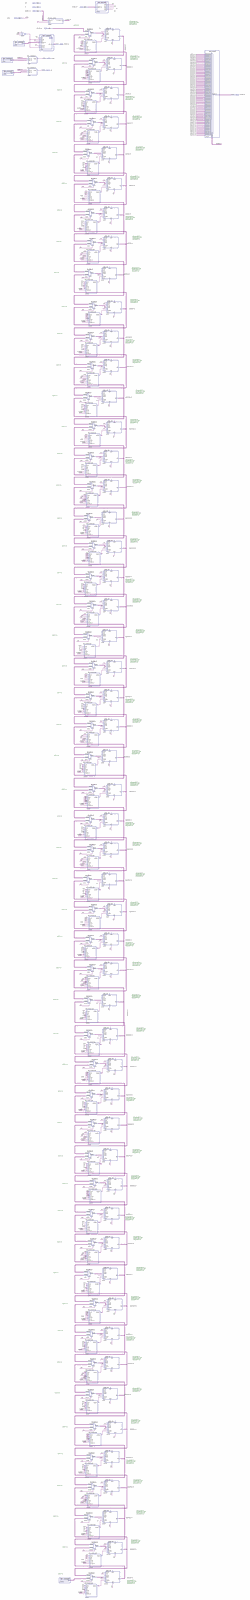
[diagram p0: schematic sheet, whole]
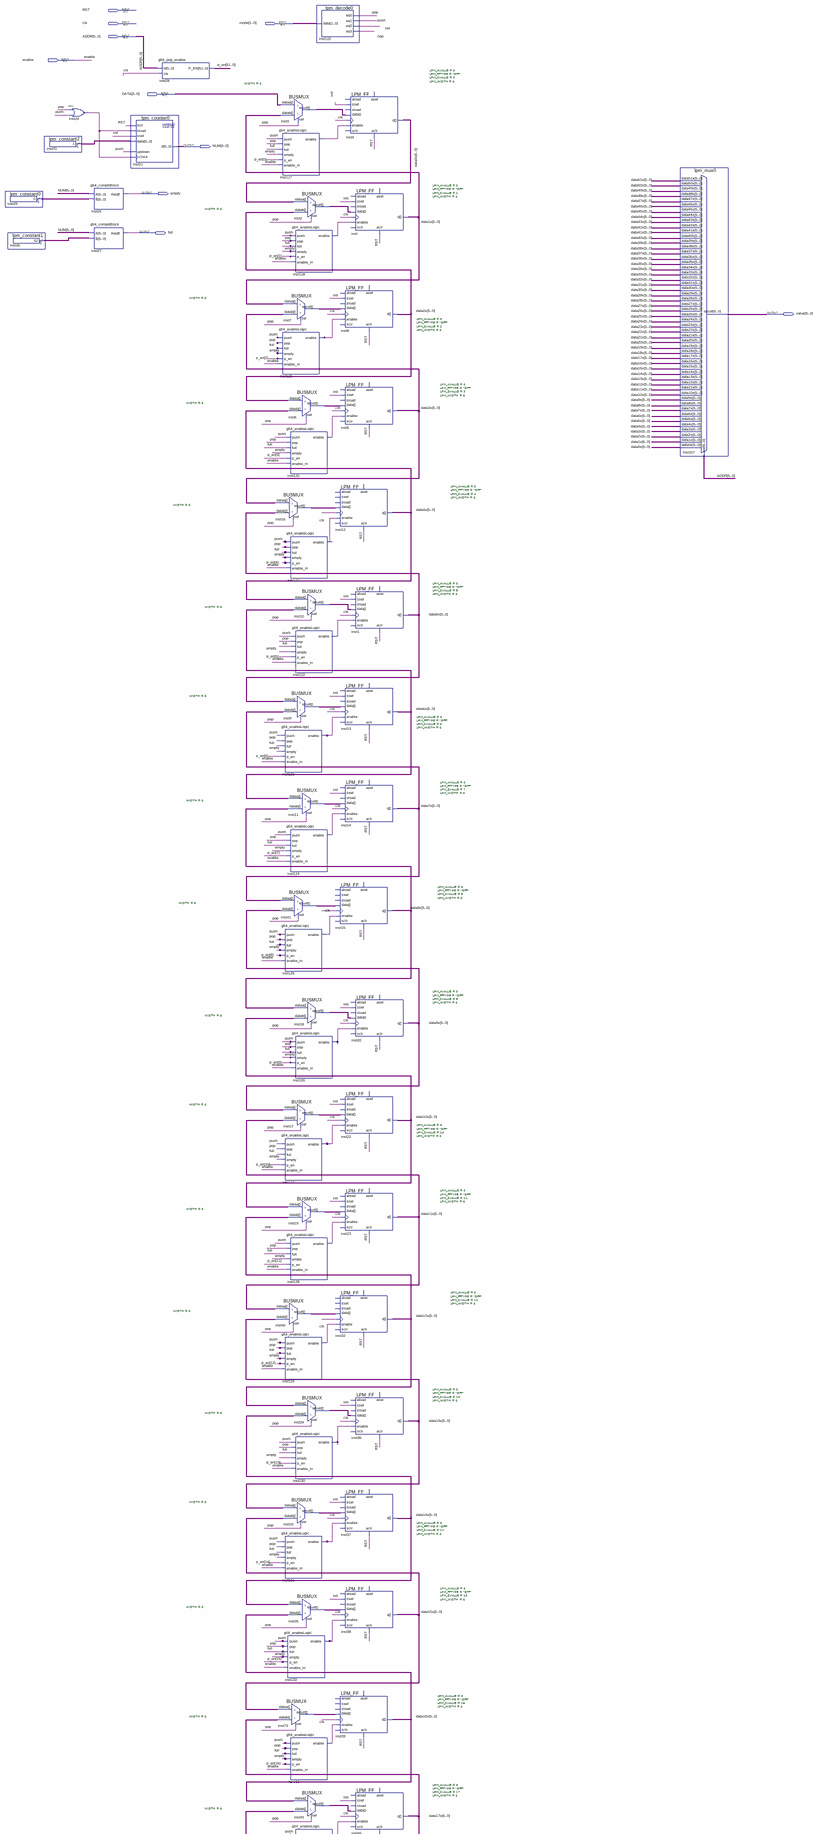
[diagram p1: schematic sheet, upper part]
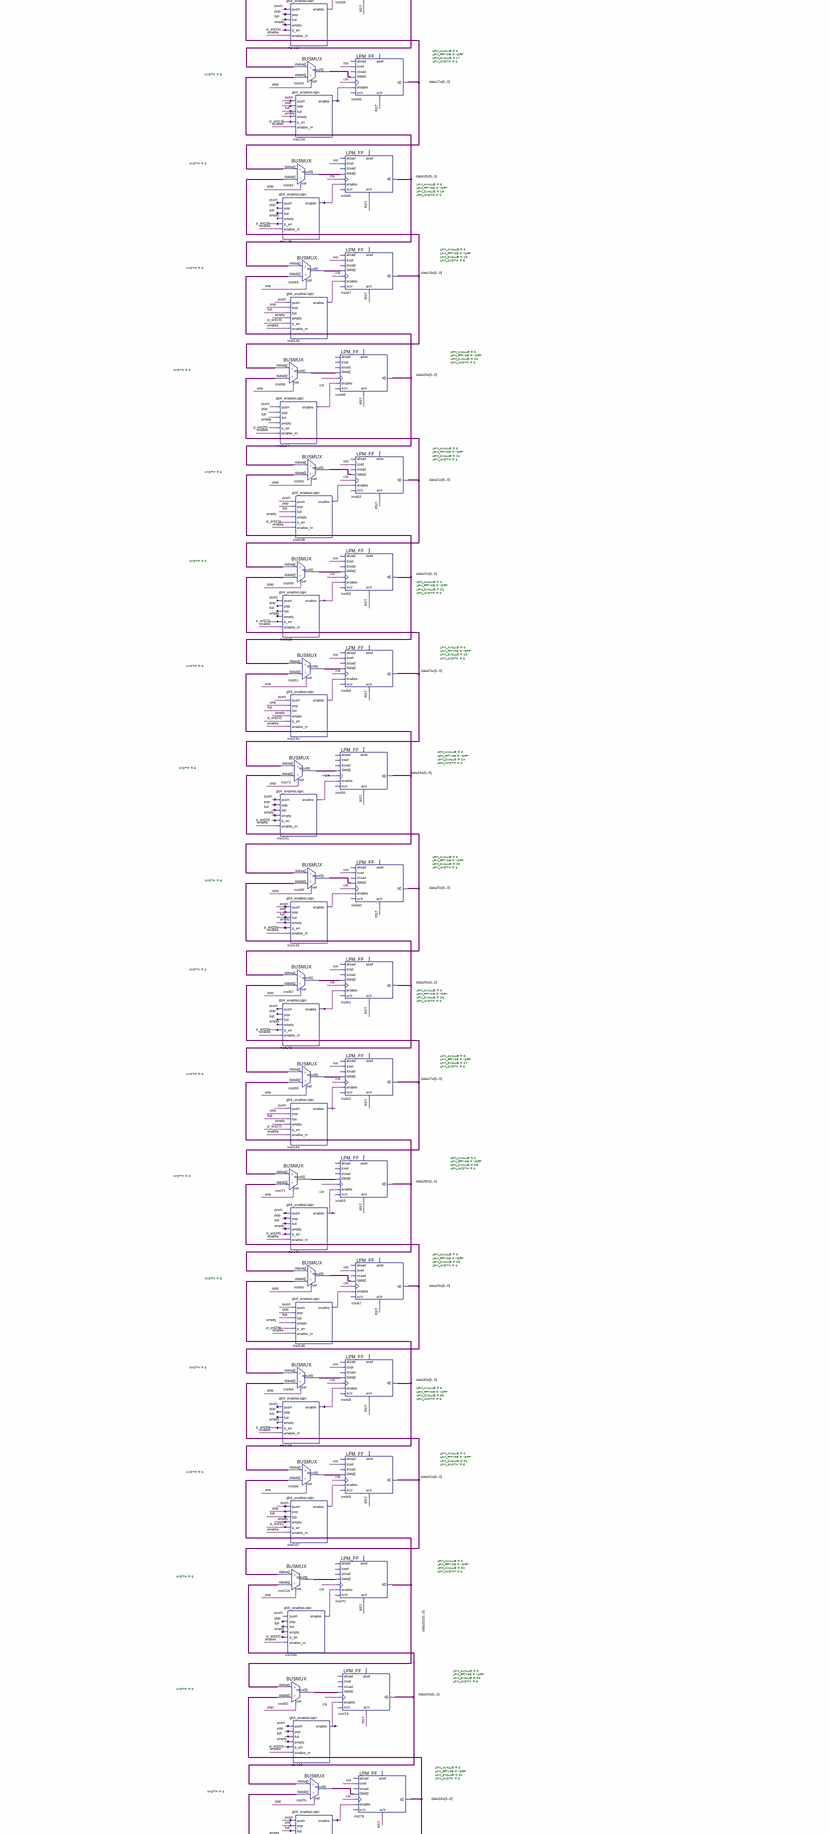
[diagram p2: schematic sheet, middle part]
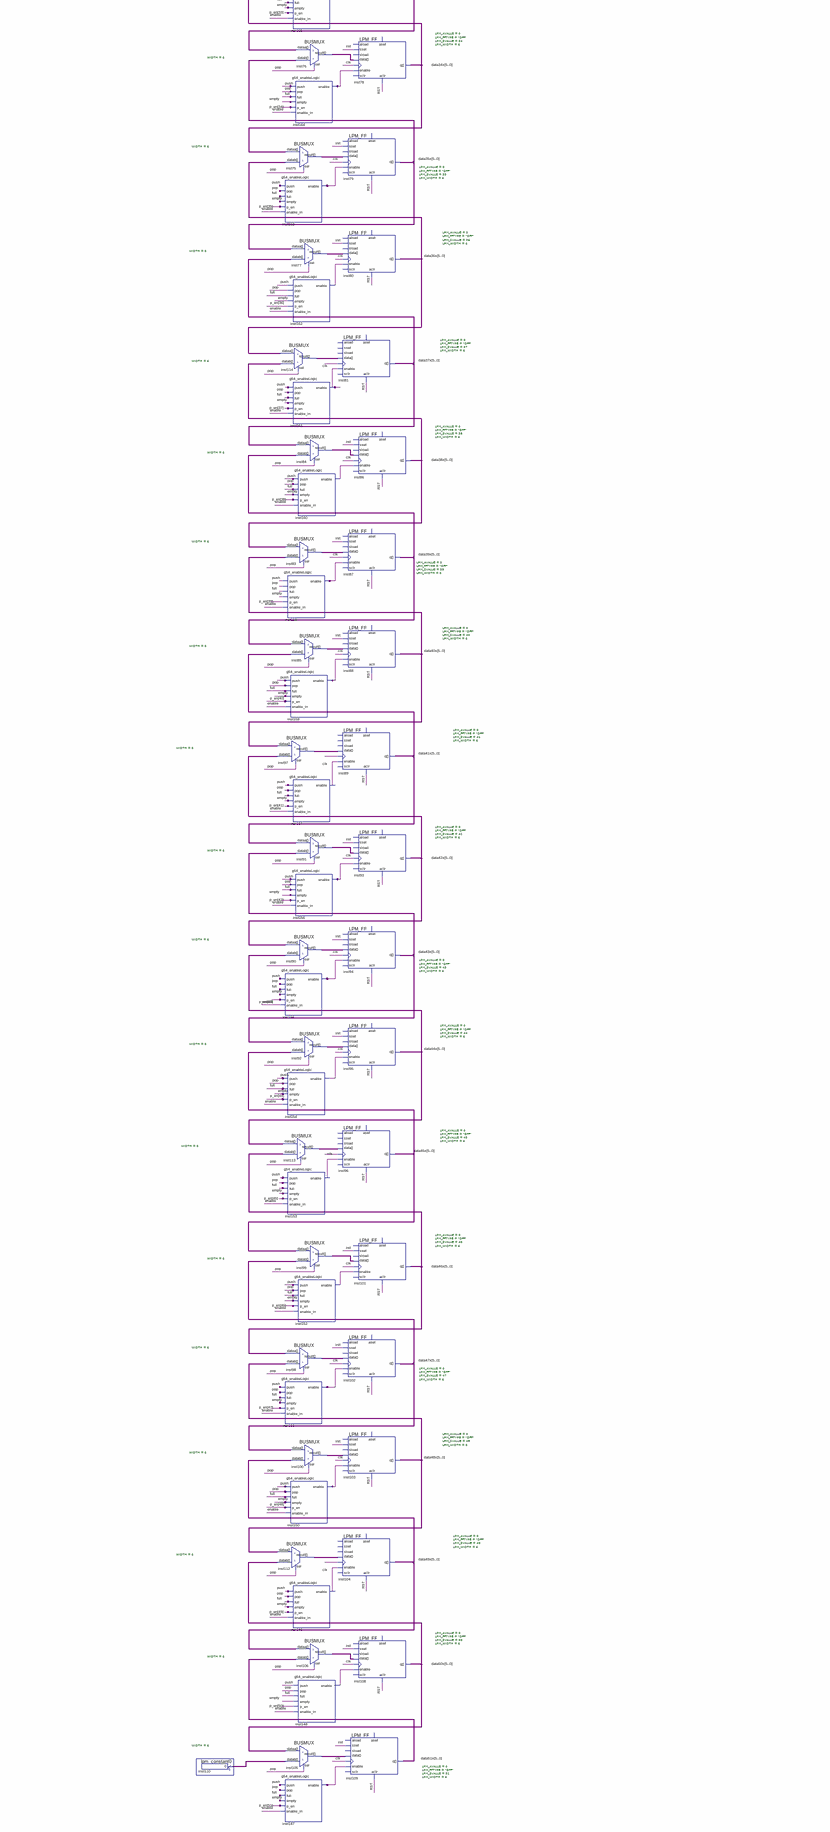
[diagram p3: schematic sheet, lower part]
// Quartus schematic g54_stack52.bdf as structural Verilog: 167 symbols, 10 pins
module g54_stack52 (
  input  RST,
  input  clk,
  input  [1:0] mode,
  input  [5:0] ADDR,
  input  enable,
  input  [5:0] DATA,
  output [5:0] NUM,
  output empty,
  output full,
  output [5:0] value
);

  wire init, inst24_out, inst117_enable, inst118_enable, inst119_enable, inst120_enable, inst121_enable,
       inst122_enable, inst123_enable, inst124_enable, inst125_enable, inst126_enable, inst127_enable,
       inst128_enable, inst129_enable, inst130_enable, inst131_enable, inst132_enable, inst133_enable,
       inst134_enable, inst135_enable, inst136_enable, inst137_enable, inst138_enable, inst139_enable,
       inst140_enable, inst141_enable, inst142_enable, inst143_enable, inst144_enable, inst145_enable,
       inst146_enable, inst147_enable, inst148_enable, inst149_enable, inst150_enable, inst151_enable,
       inst152_enable, inst153_enable, inst154_enable, inst155_enable, inst156_enable, inst157_enable,
       inst158_enable, inst159_enable, inst160_enable, inst161_enable, inst162_enable, inst163_enable,
       inst164_enable, inst165_enable, inst166_enable, inst167_enable, inst168_enable, nop, pop, push;
  wire [5:0] data0x, data1x, data2x, data3x, data4x, data5x, data6x, data7x, data8x, data9x, data10x,
       data11x, data12x, data13x, data14x, data15x, data16x, data17x, data18x, data19x, data20x, data21x,
       data22x, data23x, data24x, data25x, data26x, data27x, data28x, data29x, data30x, data31x, data32x,
       data33x, data34x, data35x, data36x, data37x, data38x, data39x, data40x, data41x, data42x, data43x,
       data44x, data45x, data46x, data47x, data48x, data49x, data50x, data51x, inst2_result, inst3_result,
       inst6_result, inst7_result, inst9_result, inst10_result, inst11_result, inst16_result, inst17_result,
       inst18_result, inst19_result, inst29_result, inst30_result, inst31_result, inst33_result,
       inst34_result, inst35_result, inst40_result, inst41_result, inst42_result, inst43_result,
       inst44_result, inst49_result, inst50_result, inst51_result, inst56_result, inst57_result,
       inst58_result, inst59_result, inst64_result, inst65_result, inst66_result, inst71_result,
       inst72_result, inst73_result, inst75_result, inst76_result, inst77_result, inst82_result,
       inst83_result, inst84_result, inst85_result, inst90_result, inst91_result, inst92_result,
       inst97_result, inst98_result, inst99_result, inst100_result, inst105_result, inst106_result,
       inst110_result, inst112_result, inst113_result, inst114_result, inst116_result;
  wire [51:0] p_en;

  lpm_constant0 inst29 (.result(inst29_result));
  lpm_constant1 inst30 (.result(inst30_result));
  lpm_constant2 inst31 (.result(inst31_result));
  or inst24 (inst24_out, pop, push);
  g54_comp6Block inst26 (.A(NUM), .B(inst29_result), .AeqB(empty));
  g54_comp6Block inst27 (.A(NUM), .B(inst30_result), .AeqB(full));
  lpm_counter0 inst21 (
    .sclr(RST), .sload(inst24_out), .data(inst31_result), .sset(init), .updown(push), .clock(inst24_out),
    .q(NUM));
  g54_pop_enable inst28 (.N(ADDR), .clk(clk), .P_EN(p_en));
  lpm_constant0 inst110 (.result(inst110_result));
  BUSMUX #(.WIDTH(6)) inst3 (.datab(data1x), .sel(pop), .dataa(DATA), .result(inst3_result));
  g54_enableLogic inst117 (
    .push(push), .pop(pop), .full(full), .empty(empty), .p_en(p_en[0]), .enable_in(enable),
    .enable(inst117_enable));
  BUSMUX #(.WIDTH(6)) inst7 (.datab(data3x), .sel(pop), .dataa(data1x), .result(inst7_result));
  g54_enableLogic inst119 (
    .push(push), .pop(pop), .full(full), .empty(empty), .p_en(p_en[2]), .enable_in(enable),
    .enable(inst119_enable));
  BUSMUX #(.WIDTH(6)) inst6 (.datab(data4x), .sel(pop), .dataa(data2x), .result(inst6_result));
  g54_enableLogic inst120 (
    .push(push), .pop(pop), .full(full), .empty(empty), .p_en(p_en[3]), .enable_in(enable),
    .enable(inst120_enable));
  BUSMUX #(.WIDTH(6)) inst16 (.datab(data5x), .sel(pop), .dataa(data3x), .result(inst16_result));
  g54_enableLogic inst121 (
    .push(push), .pop(pop), .full(full), .empty(empty), .p_en(p_en[4]), .enable_in(enable),
    .enable(inst121_enable));
  BUSMUX #(.WIDTH(6)) inst9 (.datab(data7x), .sel(pop), .dataa(data5x), .result(inst9_result));
  g54_enableLogic inst123 (
    .push(push), .pop(pop), .full(full), .empty(empty), .p_en(p_en[6]), .enable_in(enable),
    .enable(inst123_enable));
  BUSMUX #(.WIDTH(6)) inst11 (.datab(data8x), .sel(pop), .dataa(data6x), .result(inst11_result));
  g54_enableLogic inst124 (
    .push(push), .pop(pop), .full(full), .empty(empty), .p_en(p_en[7]), .enable_in(enable),
    .enable(inst124_enable));
  BUSMUX #(.WIDTH(6)) inst41 (.datab(data9x), .sel(pop), .dataa(data7x), .result(inst41_result));
  g54_enableLogic inst125 (
    .push(push), .pop(pop), .full(full), .empty(empty), .p_en(p_en[8]), .enable_in(enable),
    .enable(inst125_enable));
  BUSMUX #(.WIDTH(6)) inst17 (.datab(data11x), .sel(pop), .dataa(data9x), .result(inst17_result));
  g54_enableLogic inst127 (
    .push(push), .pop(pop), .full(full), .empty(empty), .p_en(p_en[10]), .enable_in(enable),
    .enable(inst127_enable));
  BUSMUX #(.WIDTH(6)) inst19 (.datab(data12x), .sel(pop), .dataa(data10x), .result(inst19_result));
  g54_enableLogic inst128 (
    .push(push), .pop(pop), .full(full), .empty(empty), .p_en(p_en[11]), .enable_in(enable),
    .enable(inst128_enable));
  BUSMUX #(.WIDTH(6)) inst40 (.datab(data13x), .sel(pop), .dataa(data11x), .result(inst40_result));
  g54_enableLogic inst129 (
    .push(push), .pop(pop), .full(full), .empty(empty), .p_en(p_en[12]), .enable_in(enable),
    .enable(inst129_enable));
  BUSMUX #(.WIDTH(6)) inst33 (.datab(data15x), .sel(pop), .dataa(data13x), .result(inst33_result));
  g54_enableLogic inst131 (
    .push(push), .pop(pop), .full(full), .empty(empty), .p_en(p_en[14]), .enable_in(enable),
    .enable(inst131_enable));
  BUSMUX #(.WIDTH(6)) inst35 (.datab(data16x), .sel(pop), .dataa(data14x), .result(inst35_result));
  g54_enableLogic inst132 (
    .push(push), .pop(pop), .full(full), .empty(empty), .p_en(p_en[15]), .enable_in(enable),
    .enable(inst132_enable));
  BUSMUX #(.WIDTH(6)) inst73 (.datab(data17x), .sel(pop), .dataa(data15x), .result(inst73_result));
  g54_enableLogic inst133 (
    .push(push), .pop(pop), .full(full), .empty(empty), .p_en(p_en[16]), .enable_in(enable),
    .enable(inst133_enable));
  BUSMUX #(.WIDTH(6)) inst42 (.datab(data19x), .sel(pop), .dataa(data17x), .result(inst42_result));
  g54_enableLogic inst135 (
    .push(push), .pop(pop), .full(full), .empty(empty), .p_en(p_en[18]), .enable_in(enable),
    .enable(inst135_enable));
  BUSMUX #(.WIDTH(6)) inst44 (.datab(data20x), .sel(pop), .dataa(data18x), .result(inst44_result));
  g54_enableLogic inst136 (
    .push(push), .pop(pop), .full(full), .empty(empty), .p_en(p_en[19]), .enable_in(enable),
    .enable(inst136_enable));
  BUSMUX #(.WIDTH(6)) inst56 (.datab(data21x), .sel(pop), .dataa(data19x), .result(inst56_result));
  g54_enableLogic inst137 (
    .push(push), .pop(pop), .full(full), .empty(empty), .p_en(p_en[20]), .enable_in(enable),
    .enable(inst137_enable));
  BUSMUX #(.WIDTH(6)) inst49 (.datab(data23x), .sel(pop), .dataa(data21x), .result(inst49_result));
  g54_enableLogic inst139 (
    .push(push), .pop(pop), .full(full), .empty(empty), .p_en(p_en[22]), .enable_in(enable),
    .enable(inst139_enable));
  BUSMUX #(.WIDTH(6)) inst51 (.datab(data24x), .sel(pop), .dataa(data22x), .result(inst51_result));
  g54_enableLogic inst140 (
    .push(push), .pop(pop), .full(full), .empty(empty), .p_en(p_en[23]), .enable_in(enable),
    .enable(inst140_enable));
  BUSMUX #(.WIDTH(6)) inst72 (.datab(data25x), .sel(pop), .dataa(data23x), .result(inst72_result));
  g54_enableLogic inst141 (
    .push(push), .pop(pop), .full(full), .empty(empty), .p_en(p_en[24]), .enable_in(enable),
    .enable(inst141_enable));
  g54_enableLogic inst142 (
    .push(push), .pop(pop), .full(full), .empty(empty), .p_en(p_en[25]), .enable_in(enable),
    .enable(inst142_enable));
  BUSMUX #(.WIDTH(6)) inst57 (.datab(data27x), .sel(pop), .dataa(data25x), .result(inst57_result));
  g54_enableLogic inst143 (
    .push(push), .pop(pop), .full(full), .empty(empty), .p_en(p_en[26]), .enable_in(enable),
    .enable(inst143_enable));
  BUSMUX #(.WIDTH(6)) inst59 (.datab(data28x), .sel(pop), .dataa(data26x), .result(inst59_result));
  g54_enableLogic inst144 (
    .push(push), .pop(pop), .full(full), .empty(empty), .p_en(p_en[27]), .enable_in(enable),
    .enable(inst144_enable));
  BUSMUX #(.WIDTH(6)) inst71 (.datab(data29x), .sel(pop), .dataa(data27x), .result(inst71_result));
  g54_enableLogic inst145 (
    .push(push), .pop(pop), .full(full), .empty(empty), .p_en(p_en[28]), .enable_in(enable),
    .enable(inst145_enable));
  BUSMUX #(.WIDTH(6)) inst64 (.datab(data31x), .sel(pop), .dataa(data29x), .result(inst64_result));
  g54_enableLogic inst168 (
    .push(push), .pop(pop), .full(full), .empty(empty), .p_en(p_en[30]), .enable_in(enable),
    .enable(inst168_enable));
  BUSMUX #(.WIDTH(6)) inst66 (.datab(data32x), .sel(pop), .dataa(data30x), .result(inst66_result));
  g54_enableLogic inst167 (
    .push(push), .pop(pop), .full(full), .empty(empty), .p_en(p_en[31]), .enable_in(enable),
    .enable(inst167_enable));
  BUSMUX #(.WIDTH(6)) inst116 (.datab(data33x), .sel(pop), .dataa(data31x), .result(inst116_result));
  g54_enableLogic inst166 (
    .push(push), .pop(pop), .full(full), .empty(empty), .p_en(p_en[32]), .enable_in(enable),
    .enable(inst166_enable));
  BUSMUX #(.WIDTH(6)) inst82 (.datab(data34x), .sel(pop), .dataa(data32x), .result(inst82_result));
  g54_enableLogic inst165 (
    .push(push), .pop(pop), .full(full), .empty(empty), .p_en(p_en[33]), .enable_in(enable),
    .enable(inst165_enable));
  BUSMUX #(.WIDTH(6)) inst75 (.datab(data36x), .sel(pop), .dataa(data34x), .result(inst75_result));
  g54_enableLogic inst163 (
    .push(push), .pop(pop), .full(full), .empty(empty), .p_en(p_en[35]), .enable_in(enable),
    .enable(inst163_enable));
  g54_enableLogic inst162 (
    .push(push), .pop(pop), .full(full), .empty(empty), .p_en(p_en[36]), .enable_in(enable),
    .enable(inst162_enable));
  BUSMUX #(.WIDTH(6)) inst114 (.datab(data38x), .sel(pop), .dataa(data36x), .result(inst114_result));
  g54_enableLogic inst161 (
    .push(push), .pop(pop), .full(full), .empty(empty), .p_en(p_en[37]), .enable_in(enable),
    .enable(inst161_enable));
  BUSMUX #(.WIDTH(6)) inst83 (.datab(data40x), .sel(pop), .dataa(data38x), .result(inst83_result));
  g54_enableLogic inst159 (
    .push(push), .pop(pop), .full(full), .empty(empty), .p_en(p_en[39]), .enable_in(enable),
    .enable(inst159_enable));
  g54_enableLogic inst158 (
    .push(push), .pop(pop), .full(full), .empty(empty), .p_en(p_en[40]), .enable_in(enable),
    .enable(inst158_enable));
  BUSMUX #(.WIDTH(6)) inst97 (.datab(data42x), .sel(pop), .dataa(data40x), .result(inst97_result));
  g54_enableLogic inst157 (
    .push(push), .pop(pop), .full(full), .empty(empty), .p_en(p_en[41]), .enable_in(enable),
    .enable(inst157_enable));
  BUSMUX #(.WIDTH(6)) inst90 (.datab(data44x), .sel(pop), .dataa(data42x), .result(inst90_result));
  g54_enableLogic inst155 (
    .push(push), .pop(pop), .full(full), .empty(empty), .p_en(p_en[43]), .enable_in(enable),
    .enable(inst155_enable));
  g54_enableLogic inst154 (
    .push(push), .pop(pop), .full(full), .empty(empty), .p_en(p_en[44]), .enable_in(enable),
    .enable(inst154_enable));
  BUSMUX #(.WIDTH(6)) inst113 (.datab(data46x), .sel(pop), .dataa(data44x), .result(inst113_result));
  g54_enableLogic inst153 (
    .push(push), .pop(pop), .full(full), .empty(empty), .p_en(p_en[45]), .enable_in(enable),
    .enable(inst153_enable));
  BUSMUX #(.WIDTH(6)) inst98 (.datab(data48x), .sel(pop), .dataa(data46x), .result(inst98_result));
  g54_enableLogic inst151 (
    .push(push), .pop(pop), .full(full), .empty(empty), .p_en(p_en[47]), .enable_in(enable),
    .enable(inst151_enable));
  g54_enableLogic inst150 (
    .push(push), .pop(pop), .full(full), .empty(empty), .p_en(p_en[48]), .enable_in(enable),
    .enable(inst150_enable));
  BUSMUX #(.WIDTH(6)) inst112 (.datab(data50x), .sel(pop), .dataa(data48x), .result(inst112_result));
  g54_enableLogic inst149 (
    .push(push), .pop(pop), .full(full), .empty(empty), .p_en(p_en[49]), .enable_in(enable),
    .enable(inst149_enable));
  BUSMUX #(.WIDTH(6)) inst105 (.datab(inst110_result), .sel(pop), .dataa(data50x), .result(inst105_result));
  g54_enableLogic inst147 (
    .push(push), .pop(pop), .full(full), .empty(empty), .p_en(p_en[51]), .enable_in(enable),
    .enable(inst147_enable));
  BUSMUX #(.WIDTH(6)) inst2 (.datab(data2x), .sel(pop), .dataa(data0x), .result(inst2_result));
  g54_enableLogic inst118 (
    .push(push), .pop(pop), .full(full), .empty(empty), .p_en(p_en[1]), .enable_in(enable),
    .enable(inst118_enable));
  BUSMUX #(.WIDTH(6)) inst10 (.datab(data6x), .sel(pop), .dataa(data4x), .result(inst10_result));
  g54_enableLogic inst122 (
    .push(push), .pop(pop), .full(full), .empty(empty), .p_en(p_en[5]), .enable_in(enable),
    .enable(inst122_enable));
  BUSMUX #(.WIDTH(6)) inst18 (.datab(data10x), .sel(pop), .dataa(data8x), .result(inst18_result));
  g54_enableLogic inst126 (
    .push(push), .pop(pop), .full(full), .empty(empty), .p_en(p_en[9]), .enable_in(enable),
    .enable(inst126_enable));
  BUSMUX #(.WIDTH(6)) inst34 (.datab(data14x), .sel(pop), .dataa(data12x), .result(inst34_result));
  g54_enableLogic inst130 (
    .push(push), .pop(pop), .full(full), .empty(empty), .p_en(p_en[13]), .enable_in(enable),
    .enable(inst130_enable));
  BUSMUX #(.WIDTH(6)) inst43 (.datab(data18x), .sel(pop), .dataa(data16x), .result(inst43_result));
  g54_enableLogic inst134 (
    .push(push), .pop(pop), .full(full), .empty(empty), .p_en(p_en[17]), .enable_in(enable),
    .enable(inst134_enable));
  BUSMUX #(.WIDTH(6)) inst50 (.datab(data22x), .sel(pop), .dataa(data20x), .result(inst50_result));
  g54_enableLogic inst138 (
    .push(push), .pop(pop), .full(full), .empty(empty), .p_en(p_en[21]), .enable_in(enable),
    .enable(inst138_enable));
  BUSMUX #(.WIDTH(6)) inst58 (.datab(data26x), .sel(pop), .dataa(data24x), .result(inst58_result));
  BUSMUX #(.WIDTH(6)) inst65 (.datab(data30x), .sel(pop), .dataa(data28x), .result(inst65_result));
  g54_enableLogic inst146 (
    .push(push), .pop(pop), .full(full), .empty(empty), .p_en(p_en[29]), .enable_in(enable),
    .enable(inst146_enable));
  BUSMUX #(.WIDTH(6)) inst76 (.datab(data35x), .sel(pop), .dataa(data33x), .result(inst76_result));
  g54_enableLogic inst164 (
    .push(push), .pop(pop), .full(full), .empty(empty), .p_en(p_en[34]), .enable_in(enable),
    .enable(inst164_enable));
  BUSMUX #(.WIDTH(6)) inst77 (.datab(data37x), .sel(pop), .dataa(data35x), .result(inst77_result));
  BUSMUX #(.WIDTH(6)) inst84 (.datab(data39x), .sel(pop), .dataa(data37x), .result(inst84_result));
  g54_enableLogic inst160 (
    .push(push), .pop(pop), .full(full), .empty(empty), .p_en(p_en[38]), .enable_in(enable),
    .enable(inst160_enable));
  BUSMUX #(.WIDTH(6)) inst85 (.datab(data41x), .sel(pop), .dataa(data39x), .result(inst85_result));
  BUSMUX #(.WIDTH(6)) inst91 (.datab(data43x), .sel(pop), .dataa(data41x), .result(inst91_result));
  g54_enableLogic inst156 (
    .push(push), .pop(pop), .full(full), .empty(empty), .p_en(p_en[42]), .enable_in(enable),
    .enable(inst156_enable));
  BUSMUX #(.WIDTH(6)) inst92 (.datab(data45x), .sel(pop), .dataa(data43x), .result(inst92_result));
  BUSMUX #(.WIDTH(6)) inst99 (.datab(data47x), .sel(pop), .dataa(data45x), .result(inst99_result));
  g54_enableLogic inst152 (
    .push(push), .pop(pop), .full(full), .empty(empty), .p_en(p_en[46]), .enable_in(enable),
    .enable(inst152_enable));
  BUSMUX #(.WIDTH(6)) inst100 (.datab(data49x), .sel(pop), .dataa(data47x), .result(inst100_result));
  BUSMUX #(.WIDTH(6)) inst106 (.datab(data51x), .sel(pop), .dataa(data49x), .result(inst106_result));
  g54_enableLogic inst148 (
    .push(push), .pop(pop), .full(full), .empty(empty), .p_en(p_en[50]), .enable_in(enable),
    .enable(inst148_enable));
  lpm_decode0 inst115 (.data(mode), .eq0(pop), .eq1(push), .eq2(init), .eq3(nop));
  LPM_FF #(.LPM_AVALUE(0), .LPM_FFTYPE("DFF"), .LPM_SVALUE(0), .LPM_WIDTH(6)) inst4 (
    .enable(inst117_enable), .clock(clk), .sset(init), .aclr(RST), .data(inst3_result), .q(data0x));  // open: aload, sload, aset, sclr
  LPM_FF #(.LPM_AVALUE(0), .LPM_FFTYPE("DFF"), .LPM_SVALUE(1), .LPM_WIDTH(6)) inst (
    .enable(inst118_enable), .clock(clk), .sset(init), .aclr(RST), .data(inst2_result), .q(data1x));  // open: aload, sload, aset, sclr
  LPM_FF #(.LPM_AVALUE(0), .LPM_FFTYPE("DFF"), .LPM_SVALUE(2), .LPM_WIDTH(6)) inst8 (
    .enable(inst119_enable), .clock(clk), .sset(init), .aclr(RST), .data(inst7_result), .q(data2x));  // open: aload, sload, aset, sclr
  LPM_FF #(.LPM_AVALUE(0), .LPM_FFTYPE("DFF"), .LPM_SVALUE(3), .LPM_WIDTH(6)) inst5 (
    .enable(inst120_enable), .clock(clk), .sset(init), .aclr(RST), .data(inst6_result), .q(data3x));  // open: aload, sload, aset, sclr
  LPM_FF #(.LPM_AVALUE(0), .LPM_FFTYPE("DFF"), .LPM_SVALUE(4), .LPM_WIDTH(6)) inst12 (
    .enable(inst121_enable), .clock(clk), .aclr(RST), .data(inst16_result), .q(data4x));  // open: aload, sset, sload, aset, sclr
  LPM_FF #(.LPM_AVALUE(0), .LPM_FFTYPE("DFF"), .LPM_SVALUE(5), .LPM_WIDTH(6)) inst1 (
    .enable(inst122_enable), .clock(clk), .sset(init), .aclr(RST), .data(inst10_result), .q(data5x));  // open: aload, sload, aset, sclr
  LPM_FF #(.LPM_AVALUE(0), .LPM_FFTYPE("DFF"), .LPM_SVALUE(6), .LPM_WIDTH(6)) inst13 (
    .aclr(RST), .clock(clk), .data(inst9_result), .enable(inst123_enable), .sset(init), .q(data6x));  // open: aload, aset, sclr, sload
  LPM_FF #(.LPM_AVALUE(0), .LPM_FFTYPE("DFF"), .LPM_SVALUE(7), .LPM_WIDTH(6)) inst14 (
    .enable(inst124_enable), .clock(clk), .sset(init), .aclr(RST), .data(inst11_result), .q(data7x));  // open: aload, sload, aset, sclr
  LPM_FF #(.LPM_AVALUE(0), .LPM_FFTYPE("DFF"), .LPM_SVALUE(8), .LPM_WIDTH(6)) inst15 (
    .enable(inst125_enable), .clock(clk), .aclr(RST), .data(inst41_result), .q(data8x));  // open: aload, sset, sload, aset, sclr
  LPM_FF #(.LPM_AVALUE(0), .LPM_FFTYPE("DFF"), .LPM_SVALUE(9), .LPM_WIDTH(6)) inst20 (
    .enable(inst126_enable), .clock(clk), .sset(init), .aclr(RST), .data(inst18_result), .q(data9x));  // open: aload, sload, aset, sclr
  LPM_FF #(.LPM_AVALUE(0), .LPM_FFTYPE("DFF"), .LPM_SVALUE(10), .LPM_WIDTH(6)) inst22 (
    .enable(inst127_enable), .clock(clk), .sset(init), .aclr(RST), .data(inst17_result), .q(data10x));  // open: aload, sload, aset, sclr
  LPM_FF #(.LPM_AVALUE(0), .LPM_FFTYPE("DFF"), .LPM_SVALUE(11), .LPM_WIDTH(6)) inst23 (
    .enable(inst128_enable), .clock(clk), .sset(init), .aclr(RST), .data(inst19_result), .q(data11x));  // open: aload, sload, aset, sclr
  LPM_FF #(.LPM_AVALUE(0), .LPM_FFTYPE("DFF"), .LPM_SVALUE(12), .LPM_WIDTH(6)) inst32 (
    .enable(inst129_enable), .clock(clk), .aclr(RST), .data(inst40_result), .q(data12x));  // open: aload, sset, sload, aset, sclr
  LPM_FF #(.LPM_AVALUE(0), .LPM_FFTYPE("DFF"), .LPM_SVALUE(13), .LPM_WIDTH(6)) inst36 (
    .enable(inst130_enable), .clock(clk), .sset(init), .aclr(RST), .data(inst34_result), .q(data13x));  // open: aload, sload, aset, sclr
  LPM_FF #(.LPM_AVALUE(0), .LPM_FFTYPE("DFF"), .LPM_SVALUE(14), .LPM_WIDTH(6)) inst37 (
    .enable(inst131_enable), .clock(clk), .sset(init), .aclr(RST), .data(inst33_result), .q(data14x));  // open: aload, sload, aset, sclr
  LPM_FF #(.LPM_AVALUE(0), .LPM_FFTYPE("DFF"), .LPM_SVALUE(15), .LPM_WIDTH(6)) inst38 (
    .enable(inst132_enable), .clock(clk), .sset(init), .aclr(RST), .data(inst35_result), .q(data15x));  // open: aload, sload, aset, sclr
  LPM_FF #(.LPM_AVALUE(0), .LPM_FFTYPE("DFF"), .LPM_SVALUE(16), .LPM_WIDTH(6)) inst39 (
    .enable(inst133_enable), .clock(clk), .aclr(RST), .data(inst73_result), .q(data16x));  // open: aload, sset, sload, aset, sclr
  LPM_FF #(.LPM_AVALUE(0), .LPM_FFTYPE("DFF"), .LPM_SVALUE(17), .LPM_WIDTH(6)) inst45 (
    .enable(inst134_enable), .clock(clk), .sset(init), .aclr(RST), .data(inst43_result), .q(data17x));  // open: aload, sload, aset, sclr
  LPM_FF #(.LPM_AVALUE(0), .LPM_FFTYPE("DFF"), .LPM_SVALUE(18), .LPM_WIDTH(6)) inst46 (
    .enable(inst135_enable), .clock(clk), .sset(init), .aclr(RST), .data(inst42_result), .q(data18x));  // open: aload, sload, aset, sclr
  LPM_FF #(.LPM_AVALUE(0), .LPM_FFTYPE("DFF"), .LPM_SVALUE(19), .LPM_WIDTH(6)) inst47 (
    .enable(inst136_enable), .clock(clk), .sset(init), .aclr(RST), .data(inst44_result), .q(data19x));  // open: aload, sload, aset, sclr
  LPM_FF #(.LPM_AVALUE(0), .LPM_FFTYPE("DFF"), .LPM_SVALUE(20), .LPM_WIDTH(6)) inst48 (
    .enable(inst137_enable), .clock(clk), .aclr(RST), .data(inst56_result), .q(data20x));  // open: aload, sset, sload, aset, sclr
  LPM_FF #(.LPM_AVALUE(0), .LPM_FFTYPE("DFF"), .LPM_SVALUE(21), .LPM_WIDTH(6)) inst52 (
    .enable(inst138_enable), .clock(clk), .sset(init), .aclr(RST), .data(inst50_result), .q(data21x));  // open: aload, sload, aset, sclr
  LPM_FF #(.LPM_AVALUE(0), .LPM_FFTYPE("DFF"), .LPM_SVALUE(22), .LPM_WIDTH(6)) inst53 (
    .enable(inst139_enable), .clock(clk), .sset(init), .aclr(RST), .data(inst49_result), .q(data22x));  // open: aload, sload, aset, sclr
  LPM_FF #(.LPM_AVALUE(0), .LPM_FFTYPE("DFF"), .LPM_SVALUE(23), .LPM_WIDTH(6)) inst54 (
    .enable(inst140_enable), .clock(clk), .sset(init), .aclr(RST), .data(inst51_result), .q(data23x));  // open: aload, sload, aset, sclr
  LPM_FF #(.LPM_AVALUE(0), .LPM_FFTYPE("DFF"), .LPM_SVALUE(24), .LPM_WIDTH(6)) inst55 (
    .enable(inst141_enable), .clock(clk), .aclr(RST), .data(inst72_result), .q(data24x));  // open: aload, sset, sload, aset, sclr
  LPM_FF #(.LPM_AVALUE(0), .LPM_FFTYPE("DFF"), .LPM_SVALUE(25), .LPM_WIDTH(6)) inst60 (
    .enable(inst142_enable), .clock(clk), .sset(init), .aclr(RST), .data(inst58_result), .q(data25x));  // open: aload, sload, aset, sclr
  LPM_FF #(.LPM_AVALUE(0), .LPM_FFTYPE("DFF"), .LPM_SVALUE(26), .LPM_WIDTH(6)) inst61 (
    .enable(inst143_enable), .clock(clk), .sset(init), .aclr(RST), .data(inst57_result), .q(data26x));  // open: aload, sload, aset, sclr
  LPM_FF #(.LPM_AVALUE(0), .LPM_FFTYPE("DFF"), .LPM_SVALUE(27), .LPM_WIDTH(6)) inst62 (
    .enable(inst144_enable), .clock(clk), .sset(init), .aclr(RST), .data(inst59_result), .q(data27x));  // open: aload, sload, aset, sclr
  LPM_FF #(.LPM_AVALUE(0), .LPM_FFTYPE("DFF"), .LPM_SVALUE(28), .LPM_WIDTH(6)) inst63 (
    .enable(inst145_enable), .clock(clk), .aclr(RST), .data(inst71_result), .q(data28x));  // open: aload, sset, sload, aset, sclr
  LPM_FF #(.LPM_AVALUE(0), .LPM_FFTYPE("DFF"), .LPM_SVALUE(29), .LPM_WIDTH(6)) inst67 (
    .enable(inst146_enable), .clock(clk), .sset(init), .aclr(RST), .data(inst65_result), .q(data29x));  // open: aload, sload, aset, sclr
  LPM_FF #(.LPM_AVALUE(0), .LPM_FFTYPE("DFF"), .LPM_SVALUE(30), .LPM_WIDTH(6)) inst68 (
    .enable(inst168_enable), .clock(clk), .sset(init), .aclr(RST), .data(inst64_result), .q(data30x));  // open: aload, sload, aset, sclr
  LPM_FF #(.LPM_AVALUE(0), .LPM_FFTYPE("DFF"), .LPM_SVALUE(31), .LPM_WIDTH(6)) inst69 (
    .enable(inst167_enable), .clock(clk), .sset(init), .aclr(RST), .data(inst66_result), .q(data31x));  // open: aload, sload, aset, sclr
  LPM_FF #(.LPM_AVALUE(0), .LPM_FFTYPE("DFF"), .LPM_SVALUE(32), .LPM_WIDTH(6)) inst70 (
    .enable(inst166_enable), .clock(clk), .aclr(RST), .data(inst116_result), .q(data32x));  // open: aload, sset, sload, aset, sclr
  LPM_FF #(.LPM_AVALUE(0), .LPM_FFTYPE("DFF"), .LPM_SVALUE(33), .LPM_WIDTH(6)) inst74 (
    .enable(inst165_enable), .clock(clk), .aclr(RST), .data(inst82_result), .q(data33x));  // open: aload, sset, sload, aset, sclr
  LPM_FF #(.LPM_AVALUE(0), .LPM_FFTYPE("DFF"), .LPM_SVALUE(35), .LPM_WIDTH(6)) inst79 (
    .enable(inst163_enable), .clock(clk), .sset(init), .aclr(RST), .data(inst75_result), .q(data35x));  // open: aload, sload, aset, sclr
  LPM_FF #(.LPM_AVALUE(0), .LPM_FFTYPE("DFF"), .LPM_SVALUE(36), .LPM_WIDTH(6)) inst80 (
    .enable(inst162_enable), .clock(clk), .sset(init), .aclr(RST), .data(inst77_result), .q(data36x));  // open: aload, sload, aset, sclr
  LPM_FF #(.LPM_AVALUE(0), .LPM_FFTYPE("DFF"), .LPM_SVALUE(37), .LPM_WIDTH(6)) inst81 (
    .enable(inst161_enable), .clock(clk), .aclr(RST), .data(inst114_result), .q(data37x));  // open: aload, sset, sload, aset, sclr
  LPM_FF #(.LPM_AVALUE(0), .LPM_FFTYPE("DFF"), .LPM_SVALUE(39), .LPM_WIDTH(6)) inst87 (
    .enable(inst159_enable), .clock(clk), .sset(init), .aclr(RST), .data(inst83_result), .q(data39x));  // open: aload, sload, aset, sclr
  LPM_FF #(.LPM_AVALUE(0), .LPM_FFTYPE("DFF"), .LPM_SVALUE(40), .LPM_WIDTH(6)) inst88 (
    .enable(inst158_enable), .clock(clk), .sset(init), .aclr(RST), .data(inst85_result), .q(data40x));  // open: aload, sload, aset, sclr
  LPM_FF #(.LPM_AVALUE(0), .LPM_FFTYPE("DFF"), .LPM_SVALUE(41), .LPM_WIDTH(6)) inst89 (
    .enable(inst157_enable), .clock(clk), .aclr(RST), .data(inst97_result), .q(data41x));  // open: aload, sset, sload, aset, sclr
  LPM_FF #(.LPM_AVALUE(0), .LPM_FFTYPE("DFF"), .LPM_SVALUE(43), .LPM_WIDTH(6)) inst94 (
    .enable(inst155_enable), .clock(clk), .sset(init), .aclr(RST), .data(inst90_result), .q(data43x));  // open: aload, sload, aset, sclr
  LPM_FF #(.LPM_AVALUE(0), .LPM_FFTYPE("DFF"), .LPM_SVALUE(44), .LPM_WIDTH(6)) inst95 (
    .enable(inst154_enable), .clock(clk), .sset(init), .aclr(RST), .data(inst92_result), .q(data44x));  // open: aload, sload, aset, sclr
  LPM_FF #(.LPM_AVALUE(0), .LPM_FFTYPE("DFF"), .LPM_SVALUE(45), .LPM_WIDTH(6)) inst96 (
    .enable(inst153_enable), .clock(clk), .aclr(RST), .data(inst113_result), .q(data45x));  // open: aload, sset, sload, aset, sclr
  LPM_FF #(.LPM_AVALUE(0), .LPM_FFTYPE("DFF"), .LPM_SVALUE(47), .LPM_WIDTH(6)) inst102 (
    .enable(inst151_enable), .clock(clk), .sset(init), .aclr(RST), .data(inst98_result), .q(data47x));  // open: aload, sload, aset, sclr
  LPM_FF #(.LPM_AVALUE(0), .LPM_FFTYPE("DFF"), .LPM_SVALUE(48), .LPM_WIDTH(6)) inst103 (
    .enable(inst150_enable), .clock(clk), .sset(init), .aclr(RST), .data(inst100_result), .q(data48x));  // open: aload, sload, aset, sclr
  LPM_FF #(.LPM_AVALUE(0), .LPM_FFTYPE("DFF"), .LPM_SVALUE(49), .LPM_WIDTH(6)) inst104 (
    .enable(inst149_enable), .clock(clk), .aclr(RST), .data(inst112_result), .q(data49x));  // open: aload, sset, sload, aset, sclr
  LPM_FF #(.LPM_AVALUE(0), .LPM_FFTYPE("DFF"), .LPM_SVALUE(51), .LPM_WIDTH(6)) inst109 (
    .enable(inst147_enable), .clock(clk), .sset(init), .aclr(RST), .data(inst105_result), .q(data51x));  // open: aload, sload, aset, sclr
  LPM_FF #(.LPM_AVALUE(0), .LPM_FFTYPE("DFF"), .LPM_SVALUE(34), .LPM_WIDTH(6)) inst78 (
    .enable(inst164_enable), .clock(clk), .sset(init), .aclr(RST), .data(inst76_result), .q(data34x));  // open: aload, sload, aset, sclr
  LPM_FF #(.LPM_AVALUE(0), .LPM_FFTYPE("DFF"), .LPM_SVALUE(38), .LPM_WIDTH(6)) inst86 (
    .enable(inst160_enable), .clock(clk), .sset(init), .aclr(RST), .data(inst84_result), .q(data38x));  // open: aload, sload, aset, sclr
  LPM_FF #(.LPM_AVALUE(0), .LPM_FFTYPE("DFF"), .LPM_SVALUE(42), .LPM_WIDTH(6)) inst93 (
    .enable(inst156_enable), .clock(clk), .sset(init), .aclr(RST), .data(inst91_result), .q(data42x));  // open: aload, sload, aset, sclr
  LPM_FF #(.LPM_AVALUE(0), .LPM_FFTYPE("DFF"), .LPM_SVALUE(46), .LPM_WIDTH(6)) inst101 (
    .enable(inst152_enable), .clock(clk), .sset(init), .aclr(RST), .data(inst99_result), .q(data46x));  // open: aload, sload, aset, sclr
  LPM_FF #(.LPM_AVALUE(0), .LPM_FFTYPE("DFF"), .LPM_SVALUE(50), .LPM_WIDTH(6)) inst108 (
    .enable(inst148_enable), .clock(clk), .sset(init), .aclr(RST), .data(inst106_result), .q(data50x));  // open: aload, sload, aset, sclr
  lpm_mux0 inst107 (
    .data51x(data51x), .data50x(data50x), .data49x(data49x), .data48x(data48x), .data47x(data47x),
    .data46x(data46x), .data45x(data45x), .data44x(data44x), .data43x(data43x), .data42x(data42x),
    .data41x(data41x), .data40x(data40x), .data39x(data39x), .data38x(data38x), .data37x(data37x),
    .data36x(data36x), .data35x(data35x), .data34x(data34x), .data33x(data33x), .data32x(data32x),
    .data31x(data31x), .data30x(data30x), .data29x(data29x), .data28x(data28x), .data27x(data27x),
    .data26x(data26x), .data25x(data25x), .data24x(data24x), .data23x(data23x), .data22x(data22x),
    .data21x(data21x), .data20x(data20x), .data19x(data19x), .data18x(data18x), .data17x(data17x),
    .data16x(data16x), .data15x(data15x), .data14x(data14x), .data13x(data13x), .data12x(data12x),
    .data11x(data11x), .data10x(data10x), .data9x(data9x), .data8x(data8x), .data7x(data7x), .data6x(data6x),
    .data5x(data5x), .data4x(data4x), .data3x(data3x), .data2x(data2x), .data1x(data1x), .data0x(data0x),
    .sel(ADDR), .result(value));
endmodule
